# Altium schematic sheet Alim.SchDoc
size A4; Author: Fürst Nicolas; CompanyName: ETML-ES; Address1: Avenue Rencordon 1; Address2: 1004 Lausanne; Address3: Suisse; SheetNumber: 2; SheetTotal: 2
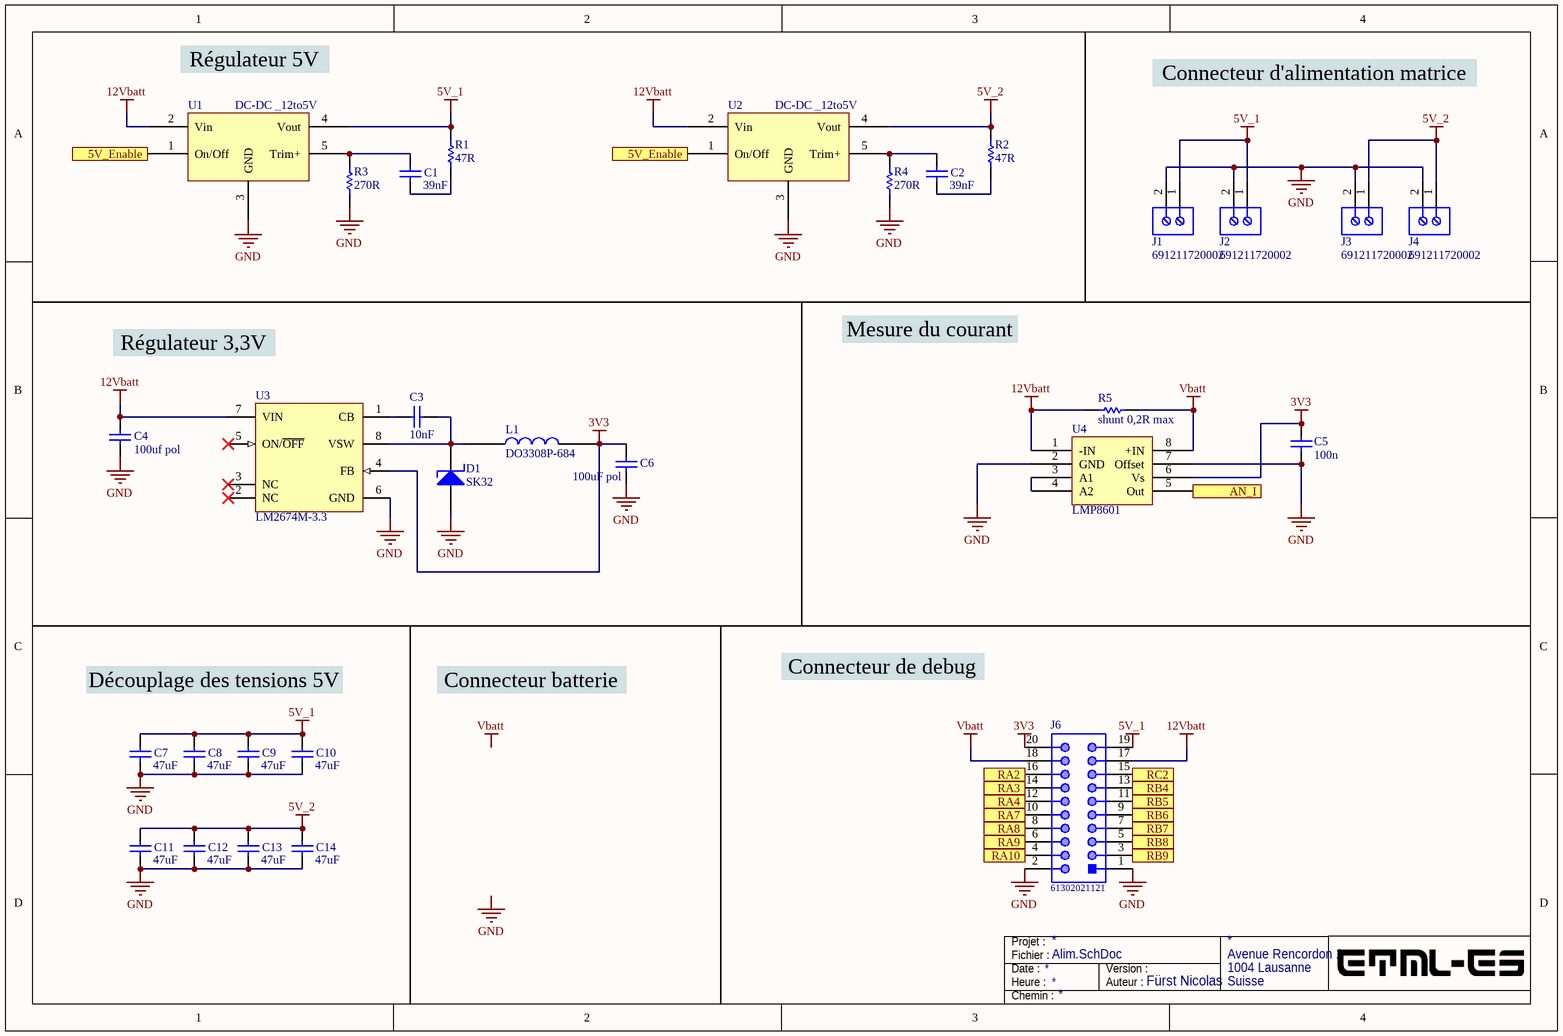
[diagram p0: Alim.SchDoc]

## Parts
C1  39nF  [CAPC0805(2012)155_L]
C2  39nF  [CAPC0805(2012)155_L]
C3  10nF  [CAPC0805(2012)155_L]
C4  100uf pol  [CAPC0805(2012)155_L]
C5  100n  [CAPC0805(2012)155_L]
C6  100uF pol  [CAPC0805(2012)155_L]
C7  47uF  [CAPC0805(2012)155_L]
C8  47uF  [CAPC0805(2012)155_L]
C9  47uF  [CAPC0805(2012)155_L]
C10  47uF  [CAPC0805(2012)155_L]
C11  47uF  [CAPC0805(2012)155_L]
C12  47uF  [CAPC0805(2012)155_L]
C13  47uF  [CAPC0805(2012)155_L]
C14  47uF  [CAPC0805(2012)155_L]
D1  SK32  [DO-214AC]
J1  691211720002  [691211720002]
J2  691211720002  [691211720002]
J3  691211720002  [691211720002]
J4  691211720002  [691211720002]
J6  61302021121  [61302021121]
L1  DO3308P-684  [DO3308P]
R1  47R  [RESC0805(2012)_N]
R2  47R  [RESC0805(2012)_N]
R3  270R  [RESC0805(2012)_N]
R4  270R  [RESC0805(2012)_N]
R5  shunt 0,2R max  [RESC0805(2012)_N]
U1  DC-DC _12to5V  [61300511121]
U2  DC-DC _12to5V  [61300511121]
U3  LM2674M-3.3  [M08A_N]
U4  LMP8601

## Ports
5V_Enable, AN_I, RA2, RA3, RA4, RA7, RA8, RA9, RA10, RB4, RB5, RB6, RB7, RB8, RB9, RC2

## Nets
3V3: C5.1 C6.2 J6.20 L1.2 U3.4(FB) U4.6(Vs)
5V_1: C7.1 C8.1 C9.1 C10.1 J1.1 J2.1 J6.19 R1.2 U1.4(Vout)
5V_2: C11.1 C12.1 C13.1 C14.1 J3.1 J4.1 R2.2 U2.4(Vout)
12Vbatt: C4.2 J6.17 R5.1 U1.2(Vin) U2.2(Vin) U3.7(VIN) U4.1(-IN)
GND: C4.1 C5.2 C6.1 C7.2 C8.2 C9.2 C10.2 C11.2 C12.2 C13.2 C14.2 D1.2(A) J1.2 J2.2 J3.2 J4.2 J6.1 J6.2 R3.1 R4.1 U1.3(GND) U2.3(GND) U3.6(GND) U4.2(GND) U4.7(Offset)
Vbatt: J6.18 R5.2 U4.8(+IN)
5V_Enable: U1.1(On/Off) U2.1(On/Off) ; port 5V_Enable
AN_I: U4.5(Out) ; port AN_I
RA2: J6.16 ; port RA2
RA3: J6.14 ; port RA3
RA4: J6.12 ; port RA4
RA7: J6.10 ; port RA7
RA8: J6.8 ; port RA8
RA9: J6.6 ; port RA9
RA10: J6.4 ; port RA10
RB4: J6.13 ; port RB4
RB5: J6.11 ; port RB5
RB6: J6.9 ; port RB6
RB7: J6.7 ; port RB7
RB8: J6.5 ; port RB8
RB9: J6.3 ; port RB9
RC2: J6.15 ; port RC2
NetC1_1: C1.1 R3.2 U1.5(Trim+)
NetC1_2: C1.2 R1.1
NetC2_1: C2.1 R2.1
NetC2_2: C2.2 R4.2 U2.5(Trim+)
NetC3_1: C3.1 U3.1(CB)
NetC3_2: C3.2 D1.1(K) L1.1 U3.8(VSW)
NetU4_3: U4.3(A1) U4.4(A2)

Not connected (* = marked no-connect by the designer): U3 2(NC)* 3(NC)* 5(ON/~{OFF})*

## Notes on the sheet
- Régulateur 5V
- Connecteur d'alimentation matrice
- Régulateur 3,3V
- Mesure du courant
- Découplage des tensions 5V
- Connecteur batterie
- Connecteur de debug
- Labels drawn without touching a wire or pin: GND, Vbatt
- Fichier :
- Date :
- Heure :
- Projet :
- Auteur :
- Version :
- Chemin :

## Library data of the parts
C1-C14 = Capa: Case-EIA: 0805; Rated Voltage: 10 V; Value: 4.7uF; Tolerance: Â±10%; Case-Metric: 2012; Max Thickness: 1.55 mm; Technology: SMT
D1 = SK32: Shotky diod; PartNumber: 151031SS04000; Manufacturer: Wuerth Elektronik; Emitting color: Super Red; ComponentLink2Description: Datasheet; ComponentLink1URL: http://www.we-online.com; ComponentLink1Description: Manufacturer URL; PackageReference: Type 3mm; ComponentLink2URL: http://katalog.we-online.de/pbs/datasheet/7448042001.pdfhttp://katalog.we-online.de/pbs/datasheet/7448042001.pdfhttp://katalog.we-online.de/pbs/datasheet/7448042001.pdfhttp://katalog.we-online.de/pbs/datasheet/151031SS04000.pdf
J1-J4 = CMP-1502-02524-1: Serie 211 - 5.00 mm 45deg Entry Modular with Rising Cage Clamp - 15.50 mm Height WR-TBL, 2 pin; Manufacturer: Wurth Elektronik; Pitch: 5.00mm; Pin Number: 2; Manufacturer URL: http://www.we-online.de; Mounting Technology: THT; Packaging: Box; Datasheet URL: http://katalog.we-online.de/em/datasheet/6912117200xx.pdf; Operating Temperature: -40to105degC; Package Reference: 691211720002; Part Number: 691211720002; Publisher: WurthElektronik
J6 = CMP-1502-01104-1: THT Vertical Pin Header WR-PHD, Pitch 2.54 mm, Dual Row, 20 pins; Manufacturer: Wurth Elektronik; Pin Number: 20; Withstanding Voltage: 500VAC; Contact Resistance: 20mOhm; Gender: Male; Working Voltage: 250VAC; Pitch: 2.54mm; Rated Current: 3A; Datasheet URL: https://katalog.we-online.de/em/datasheet/6130xx21121.pdf; Mounting Technology: THT; Package Reference: 61302021121; Manufacturer URL: http://www.we-online.de; Part Number: 61302021121; Orientation: Vertical; Operating Temperature: -40to105degC; Row Number: Dual; Publisher: WurthElektronik; Packaging: Bag
R1-R5 = Resistor: Value: 1000000.00 Ohm; Case-Metric: 2012; Case-EIA: 0805; Power: 0.125 W; Tolerance: 1 %; Technology: SMT
U3 = CMP-0069-00679-2: SIMPLE SWITCHER® Power Converter High Efficiency 500mA Step-Down Voltage Regulator, 8-pin Narrow SOIC; Manufacturer: National Semiconductor; PackageTopMarking: NSZXTT*2674*M3.3; PowerWise: N; ComponentLink1Description: LM2674 Datasheet; DatasheetVersion: Mar-2005; CompType: Switcher; ComponentLink2URL: http://www.national.com/pf/LM/LM2674.html; ComponentLink1URL: http://www.national.com/ds/LM/LM2674.pdf; RevisionNote: Component URLs added; ComponentLink2Description: LM2674 Web Page; ComponentLink3URL: http://www.national.com/packaging/folders/m08a.html; PackageVersion: revM, May-2009; PackageDescription: SOIC Narrow, 4.9 x 3.9 x 1.45mm, 8 Lead, 1.27mm Pitch; PinCount: 8; PackageReference: M08A; ComponentLink3Description: M08A Package Page; Code_IPC: SOIC127P600-8; Code_JEDEC: MS-012-AA; RoHS: N